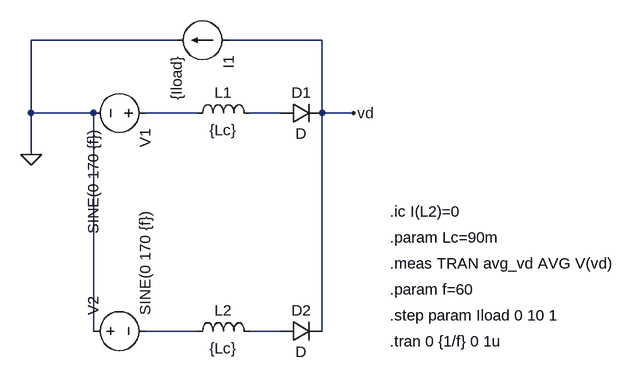
[diagram p0: schematic HW2q2c.asc]
HW2q2c.asc, the LTspice schematic file:
Version 4.1
SHEET 1 924 680
WIRE -144 -224 -368 -224
WIRE 80 -224 -64 -224
WIRE -368 -112 -368 -224
WIRE -272 -112 -368 -112
WIRE -112 -112 -192 -112
WIRE 16 -112 -32 -112
WIRE 80 -112 80 -224
WIRE 128 -112 80 -112
WIRE -368 -48 -368 -112
WIRE -272 224 -272 -112
WIRE -112 224 -192 224
WIRE 16 224 -32 224
WIRE 80 224 80 -112
FLAG -368 -48 0
FLAG 128 -112 vd
SYMBOL voltage -176 -112 R90
WINDOW 123 0 0 Left 0
WINDOW 39 0 0 Left 0
SYMATTR InstName V1
SYMATTR Value SINE(0 170 {f})
SYMBOL voltage -288 224 R270
WINDOW 123 0 0 Left 0
WINDOW 39 0 0 Left 0
SYMATTR InstName V2
SYMATTR Value SINE(0 170 {f})
SYMBOL ind -128 -96 R270
WINDOW 0 32 56 VTop 2
WINDOW 3 5 56 VBottom 2
SYMATTR InstName L1
SYMATTR Value {Lc}
SYMBOL ind -128 240 R270
WINDOW 0 32 56 VTop 2
WINDOW 3 5 56 VBottom 2
SYMATTR InstName L2
SYMATTR Value {Lc}
SYMBOL diode 16 -96 R270
WINDOW 0 32 32 VTop 2
WINDOW 3 0 32 VBottom 2
SYMATTR InstName D1
SYMBOL diode 16 240 R270
WINDOW 0 32 32 VTop 2
WINDOW 3 0 32 VBottom 2
SYMATTR InstName D2
SYMBOL current -64 -224 R90
WINDOW 123 0 0 Left 0
WINDOW 39 0 0 Left 0
SYMATTR InstName I1
SYMATTR Value {Iload}
TEXT 184 200 Left 2 !.step param Iload 0 10 1
TEXT 184 120 Left 2 !.meas TRAN avg_vd AVG V(vd)
TEXT 184 40 Left 2 !.ic I(L2)=0
TEXT 184 240 Left 2 !.tran 0 {1/f} 0 1u
TEXT 184 80 Left 2 !.param Lc=90m
TEXT 184 160 Left 2 !.param f=60

The netlist it stands for:
* HW2q2c.asc
V1 N001 0 SINE(0 170 {f})
V2 0 N003 SINE(0 170 {f})
L1 N001 N002 {Lc}
L2 N003 N004 {Lc}
D1 N002 vd D
D2 N004 vd D
I1 vd 0 {Iload}
.model D D
.lib standard.dio
.step param Iload 0 10 1
.meas TRAN avg_vd AVG V(vd)
.ic I(L2)=0
.tran 0 {1/f} 0 1u
.param Lc=90m
.param f=60
.backanno
.end